# EAGLE design USBdimmer (EAGLE 6.4)
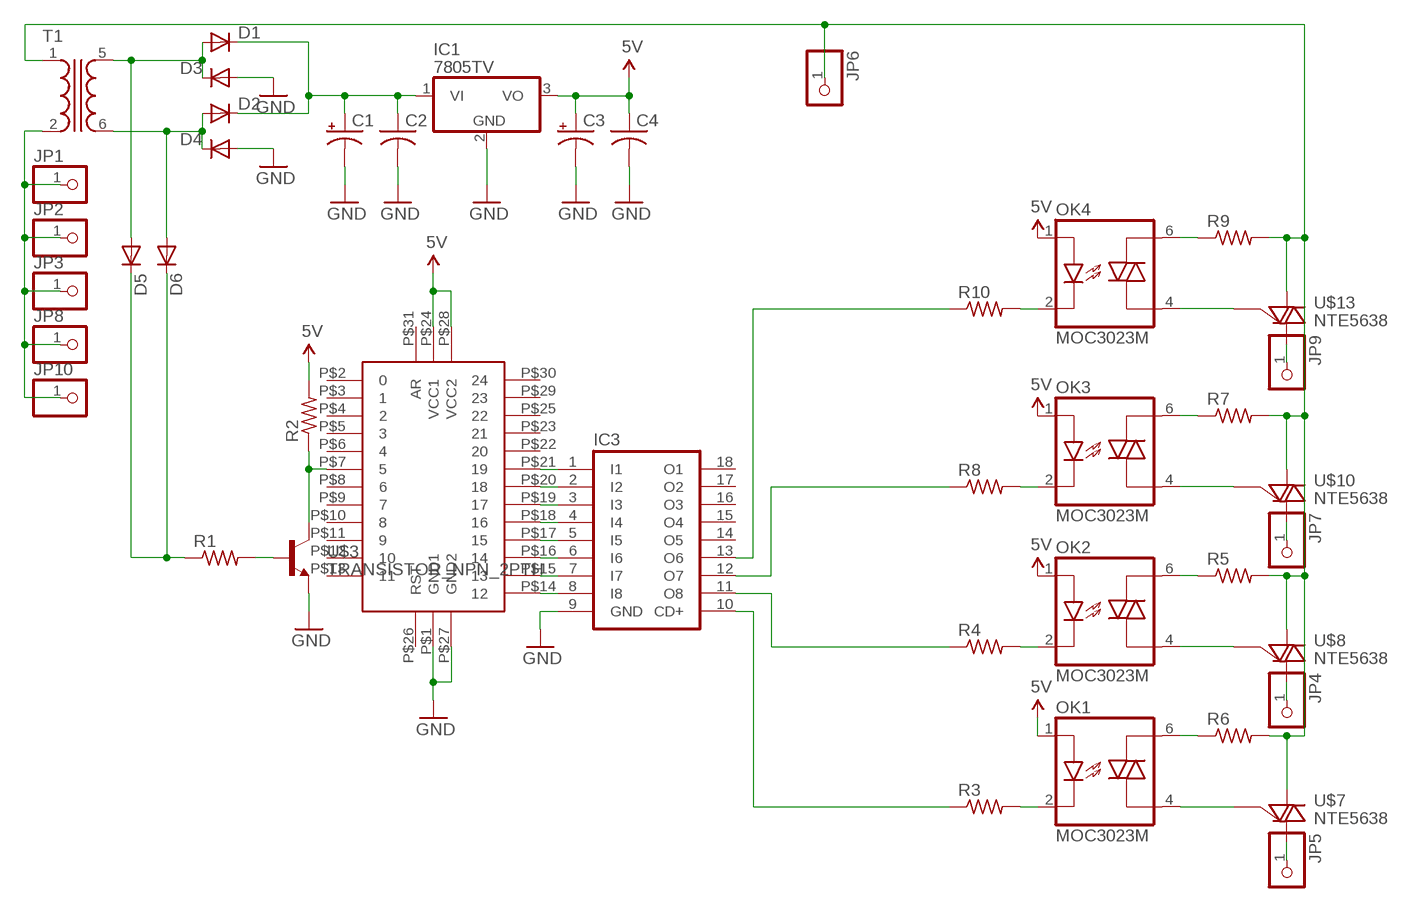
[diagram p0: schematic, sheet 1]

## Parts
C1  CPOL-USE3.5-10  [E3,5-10]
C2  C-US025-030X050  [C025-030X050]
C3  CPOL-USE3.5-10  [E3,5-10]
C4  C-US025-030X050  [C025-030X050]
D1  DIODEPTH  [DIODE-1N4001]
D2  DIODEPTH  [DIODE-1N4001]
D3  DIODEPTH  [DIODE-1N4001]
D4  DIODEPTH  [DIODE-1N4001]
D5  DIODE1N4148  [DIODE-1N4148]
D6  DIODE1N4148  [DIODE-1N4148]
IC1  7805TV  [TO220V]
IC3  ULN2803A  [DIL18]
JP1  PINHD-1X1  [1X01]
JP2  PINHD-1X1  [1X01]
JP3  PINHD-1X1  [1X01]
JP4  PINHD-1X1  [1X01]
JP5  PINHD-1X1  [1X01]
JP6  PINHD-1X1  [1X01]
JP7  PINHD-1X1  [1X01]
JP8  PINHD-1X1  [1X01]
JP9  PINHD-1X1  [1X01]
JP10  PINHD-1X1  [1X01]
OK1  MOC3023M  [DIL06]
OK2  MOC3023M  [DIL06]
OK3  MOC3023M  [DIL06]
OK4  MOC3023M  [DIL06]
R1  FLIPFLOP-RES  [0805-THM]
R2  FLIPFLOP-RES  [0805-THM]
R3  FLIPFLOP-RES  [0805-THM]
R4  FLIPFLOP-RES  [0805-THM]
R5  FLIPFLOP-RES  [0805-THM]
R6  FLIPFLOP-RES  [0805-THM]
R7  FLIPFLOP-RES  [0805-THM]
R8  FLIPFLOP-RES  [0805-THM]
R9  FLIPFLOP-RES  [0805-THM]
R10  FLIPFLOP-RES  [0805-THM]
T1  XFORMER  [T70-E]
U$1  TEENSY2  [TEENSY2]
U$3  TRANSISTOR_NPN_2PTH  [TO-92]
U$7  NTE5638  [TO220BV]
U$8  NTE5638  [TO220BV]
U$10  NTE5638  [TO220BV]
U$13  NTE5638  [TO220BV]

## Nets
5V: C3.+ C4.1 IC1.3(VO) OK1.1(A) OK2.1(A) OK3.1(A) OK4.1(A) R2.2 U$1.P$24(VCC1) U$1.P$28(VCC2)
GND: C1.- C2.2 C3.- C4.2 D3.A D4.A IC1.2(GND) IC3.9(GND) U$1.P$1(GND1) U$1.P$27(GND2) U$3.3(E)
N$1: D2.A D4.C D6.A T1.6(S2)
N$2: D1.A D3.C D5.A T1.5(S1)
N$3: C1.+ C2.1 D1.C D2.C IC1.1(VI)
N$4: IC3.1(I1) U$1.P$21
N$5: IC3.2(I2) U$1.P$20
N$6: R1.2 U$3.2(B)
N$7: D5.C D6.C R1.1
N$8: R2.1 U$1.P$7 U$3.1(C)
N$9: IC3.3(I3) U$1.P$19
N$10: IC3.4(I4) U$1.P$18
N$11: JP6.1 R5.2 R6.2 R7.2 R9.2 T1.1 U$7.1(MT1) U$8.1(MT1) U$10.1(MT1) U$13.1(MT1)
N$12: OK2.6(MT1) R5.1
N$13: OK2.4(MT2) U$8.3(G)
N$14: JP4.1 U$8.2(MT2)
N$15: OK1.6(MT1) R6.1
N$16: OK1.4(MT2) U$7.3(G)
N$17: JP5.1 U$7.2(MT2)
N$18: JP1.1 JP2.1 JP3.1 JP8.1 JP10.1 T1.2
N$19: IC3.5(I5) U$1.P$17
N$20: IC3.6(I6) U$1.P$16
N$21: OK3.6(MT1) R7.1
N$22: OK3.4(MT2) U$10.3(G)
N$23: JP7.1 U$10.2(MT2)
N$24: IC3.7(I7) U$1.P$15
N$25: IC3.8(I8) U$1.P$14
N$26: OK3.2(C) R8.2
N$27: OK2.2(C) R4.2
N$28: OK1.2(C) R3.2
N$30: OK4.6(MT1) R9.1
N$31: OK4.4(MT2) U$13.3(G)
N$32: JP9.1 U$13.2(MT2)
N$33: OK4.2(C) R10.2
N$34: IC3.10(CD+) R3.1
N$35: IC3.11(O8) R4.1
N$36: IC3.13(O6) R10.1
N$37: IC3.12(O7) R8.1
Unconnected: IC3.14(O5) IC3.15(O4) IC3.16(O3) IC3.17(O2) IC3.18(O1) T1.3(P1) T1.4(P2) T1.7(S1) T1.8(S2) U$1.P$2 U$1.P$3 U$1.P$4 U$1.P$5 U$1.P$6 U$1.P$8 U$1.P$9 U$1.P$10 U$1.P$11 U$1.P$12 U$1.P$13 U$1.P$22 U$1.P$23 U$1.P$25 U$1.P$26(RST) U$1.P$29 U$1.P$30 U$1.P$31(AR)

## Library data of the parts
C1 C3 = adafruit:CPOL-US: POLARIZED CAPACITOR, American symbol
C2 C4 = adafruit:C-US: CAPACITOR, American symbol
D1-D6 = SparkFun-DiscreteSemi:DIODE: Diode These are standard reverse protection diodes and small signal diodes. SMA package can handle up to about 1A. SOD-323 can handle about 200mA. What the SOD-323 package when ordering, there are some mfgs out there that are 5-pin packages.
IC1 = linear:78*: Positive VOLTAGE REGULATOR Source: http://cache.national.com/ds/LM/LM78L05.pdf http://www.fairchildsemi.com/ds/LM/LM7805.pdf
IC3 = uln-udn:ULN2803A: DRIVER ARRAY
JP1-JP10 = adafruit:PINHD-1X1: Pin header 1x1 for 0.1" spacing With round pins
OK1-OK4 = bodger:MOC30*M: RANDOM-PHASE OPTOISOLATORS TRIAC DRIVER OUTPUT Source: http://www.fairchildsemi.com MOC3020-M.pdf; MF: FAIRCHILD SEMICONDUCTOR; MPN: MOC3023-M; OC_FARNELL: 1021367; OC_NEWARK: 72K8896
R1-R10 = adafruit:FLIPFLOP-RES: Flip Flop resistor An 0805 resistor inside a standard 1/4W 5% resistor. Makes for easy mods
T1 = special:XFORMER: TRANSFORMER 2 x primary, 2 x secondary
U$1 = bodger:TEENSY2
U$3 = SparkFun-DiscreteSemi:TRANSISTOR_NPN_2: Alternate TO-92 NPN BJT
U$7 U$8 U$10 U$13 = bodger:NTE5638

## Board
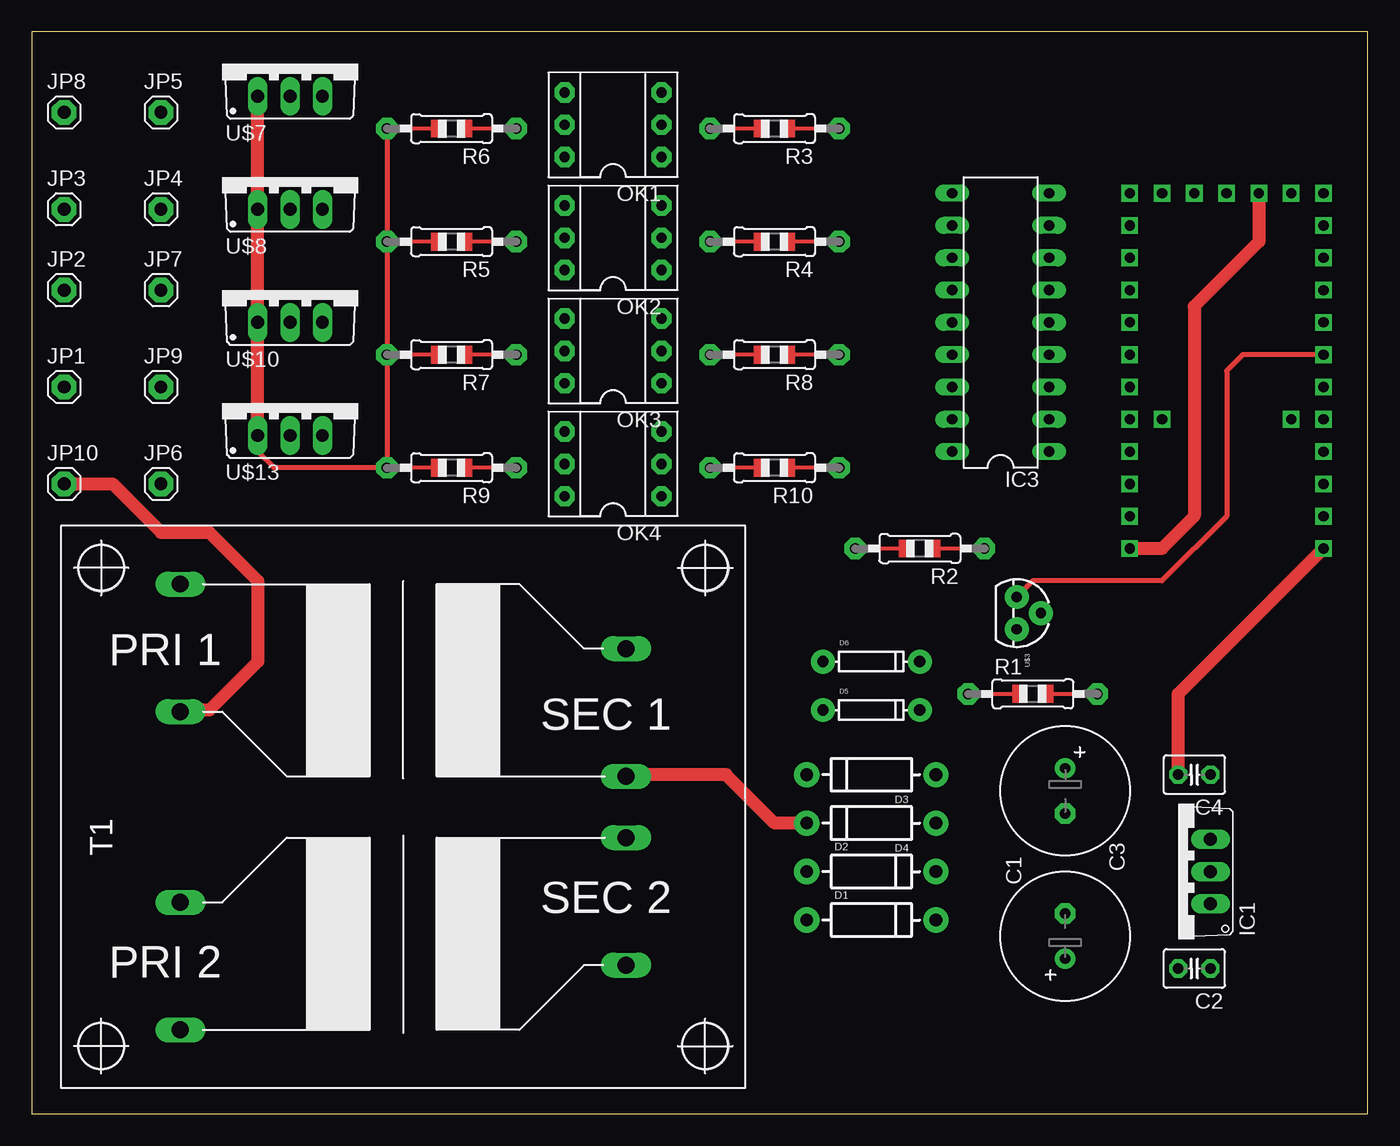
[diagram p1: board, top side]
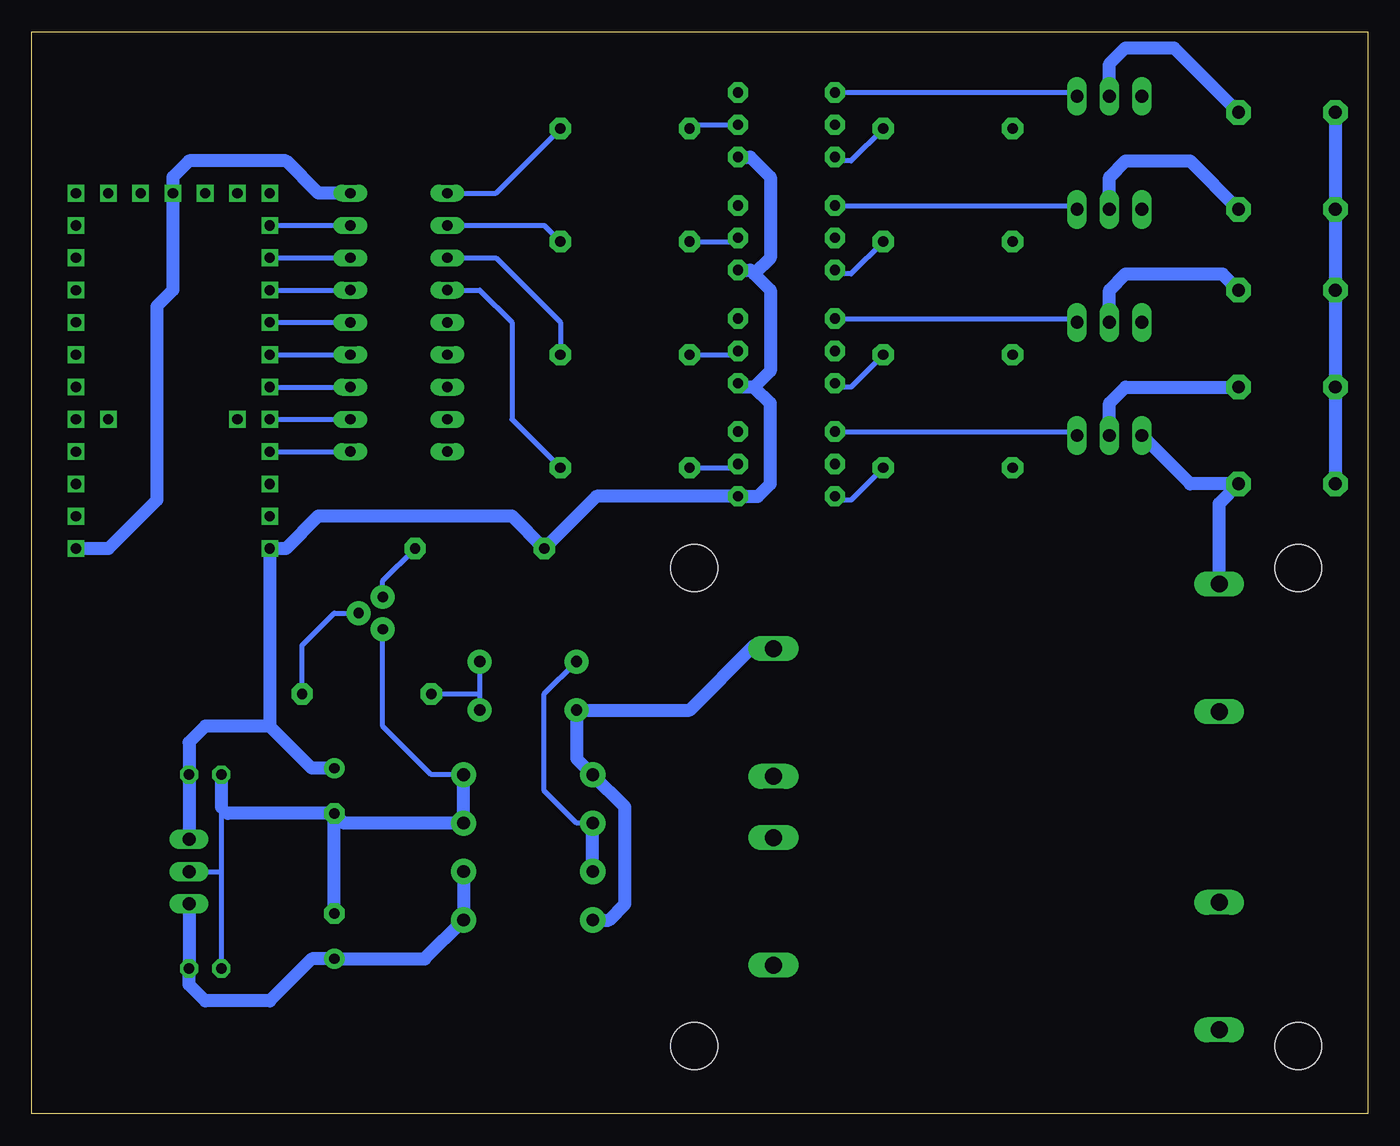
[diagram p2: board, bottom side, seen from below]

Size 105.08 x 85.08 mm. Coordinates in mm from the lower left corner, seen from the top.
Outline: 0,0 105.08,0 105.08,85.08 0,85.08 0,0
Copper layers (1*16): Top 0.035mm / dielectric 1.5mm / Bottom 0.035mm
Design rules "default": minimum track width 10mil, minimum drill 24mil, track to track 8mil, track to pad 8mil, pad to pad 8mil, via to via 8mil, smd to smd 8mil, copper to edge 40mil, drill to drill 8mil, minimum pad ring 10mil, minimum via ring 8mil, stop-mask expansion 4mil, vias tented up to drill 0mil, thermal gap 10mil

### Footprints (pad centres in the part's own frame; a part is rotated, then mirrored left to right if it is on the bottom)
E3,5-10 = drill 0.813 pad 1.6: + -1.778,0 | drill 0.813 pad 1.6 octagon: - 1.778,0
C025-030X050 = drill 0.813 pad 1.422 octagon: 1 -1.27,0; 2 1.27,0
DIODE-1N4001 = drill 1 pad 1.981: A -5.08,0; C 5.08,0
DIODE-1N4148 = drill 0.9 pad 1.88: A -3.81,0; C 3.81,0
TO220V = drill 1.016 long: 1 -2.54,-2.54; 2 0,-2.54; 3 2.54,-2.54
DIL18 = drill 0.813 long: 1 -10.16,-3.81; 2 -7.62,-3.81; 3 -5.08,-3.81; 4 -2.54,-3.81; 5 0,-3.81; 6 2.54,-3.81; 7 5.08,-3.81; 8 7.62,-3.81; 9 10.16,-3.81; 10 10.16,3.81; 11 7.62,3.81; 12 5.08,3.81; 13 2.54,3.81; 14 0,3.81; 15 -2.54,3.81; 16 -5.08,3.81; 17 -7.62,3.81; 18 -10.16,3.81
1X01 = drill 1.016 pad 1.93 octagon: 1 0,0
DIL06 = drill 0.813 pad 1.6 octagon: 1 -3.51,-3.81; 2 -0.97,-3.81; 3 1.57,-3.81; 4 1.57,3.81; 5 -0.97,3.81; 6 -3.51,3.81
0805-THM = drill 0.813 pad 1.676 octagon: 1 -5.08,0; 2 5.08,0
T70-E = drill 1.321 long: 1 -17.526,17.526; 2 -17.526,7.493; 3 -17.526,-7.493; 4 -17.526,-17.526; 5 17.526,12.446; 6 17.526,2.413; 7 17.526,-2.413; 8 17.526,-12.446 | hole 3.708: 23.749,18.796; 23.749,-18.796; -23.749,-18.796; -23.749,18.796
TEENSY2 = drill 0.8 square: P$1 -7.62,15.24; P$2 -7.62,12.7; P$3 -7.62,10.16; P$4 -7.62,7.62; P$5 -7.62,5.08; P$6 -7.62,2.54; P$7 -7.62,0; P$8 -7.62,-2.54; P$9 -7.62,-5.08; P$10 -7.62,-7.62; P$11 -7.62,-10.16; P$12 -7.62,-12.7; P$13 7.62,-12.7; P$14 7.62,-10.16; P$15 7.62,-7.62; P$16 7.62,-5.08; P$17 7.62,-2.54; P$18 7.62,0; P$19 7.62,2.54; P$20 7.62,5.08; P$21 7.62,7.62; P$22 7.62,10.16; P$23 7.62,12.7; P$24 7.62,15.24; P$25 5.08,-12.7; P$26 2.54,-12.7; P$27 0,-12.7; P$28 -2.54,-12.7; P$29 -5.08,-12.7; P$30 -5.08,5.08; P$31 5.08,5.08
TO-92 = drill 0.813 pad 1.88: 1 -1.27,0; 2 0,1.905; 3 1.27,0
TO220BV = drill 1.016 long: 1 -2.54,-2.54; 2 0,-2.54; 3 2.54,-2.54

### Placement (x,y rotation side)
C1  81.28,13.97 90 top
C2  91.44,11.43 180 top
C3  81.28,25.4 270 top
C4  91.44,26.67 180 top
D1  66.04,15.24 0 top
D2  66.04,19.05 0 top
D3  66.04,26.67 180 top
D4  66.04,22.86 180 top
D5  66.04,31.75 0 top
D6  66.04,35.56 0 top
IC1  90.17,19.05 90 top
IC3  76.2,62.23 90 top
JP1  2.54,57.15 0 top
JP2  2.54,64.77 0 top
JP3  2.54,71.12 0 top
JP4  10.16,71.12 0 top
JP5  10.16,78.74 0 top
JP6  10.16,49.53 0 top
JP7  10.16,64.77 0 top
JP8  2.54,78.74 0 top
JP9  10.16,57.15 0 top
JP10  2.54,49.53 0 top
OK1  45.72,78.74 90 top
OK2  45.72,69.85 90 top
OK3  45.72,60.96 90 top
OK4  45.72,52.07 90 top
R1  78.74,33.02 0 top
R2  69.85,44.45 180 top
R3  58.42,77.47 180 top
R4  58.42,68.58 180 top
R5  33.02,68.58 180 top
R6  33.02,77.47 180 top
R7  33.02,59.69 180 top
R8  58.42,59.69 180 top
R9  33.02,50.8 180 top
R10  58.42,50.8 180 top
T1  29.21,24.13 0 top
U$1  93.98,59.69 180 top
U$3  77.47,39.37 270 top
U$7  20.32,82.55 0 top
U$8  20.32,73.66 0 top
U$10  20.32,64.77 0 top
U$13  20.32,55.88 0 top

### Tracks (layer width: path | path; a pad name or v marks a point on that pad's centre or on a via)
5V
  Top 1.016: U$1.P$28 96.52,68.58 91.44,63.5 91.44,46.99 88.9,44.45 U$1.P$24
  Bottom 0.406: OK2.1 49.23,66.04 48.26,66.04 48.56,66.34 | 49.23,57.15 OK3.1
  Bottom 1.016: OK1.1 48.56,75.23 46.99,73.66 46.99,67.31 48.26,66.04 46.99,64.77 46.99,58.42 48.26,57.15 | OK2.1 48.56,66.34 | 48.26,57.15 49.23,57.15 | 48.26,57.15 46.99,55.88 46.99,49.53 47.96,48.56 OK4.1 60.66,48.56 R2.2 67.31,46.99 82.55,46.99 85.09,44.45 U$1.P$24 86.36,30.48 | IC1.3 C4.1 92.71,29.21 91.44,30.48 86.36,30.48 | C3.+ 83.06,27.18 86.36,30.48
GND
  Top 1.016: C4.2 90.17,33.02 U$1.P$1
  Bottom 0.406: 90.17,19.05 90.17,24.13 89.66,23.62 | 90.17,19.05 C2.2 | IC1.2 90.17,19.05 | D3.A 73.66,26.67 77.47,30.48 U$3.3
  Bottom 1.016: D3.A D4.A 80.52,22.86 C3.- | C4.2 90.17,24.13 | C1.- C3.- | C3.- 89.66,23.62 | IC3.9 82.55,72.39 85.09,74.93 92.71,74.93 93.98,73.66 U$1.P$27 93.98,64.77 95.25,63.5 95.25,48.26 99.06,44.45 U$1.P$1
N$1
  Top 1.016: D4.C 58.42,22.86 54.61,26.67 46.86,26.67 T1.6
  Bottom 0.406: D4.C 62.23,22.86 64.77,25.4 64.77,33.02 D6.A
  Bottom 1.016: D2.A D4.C
N$2
  Bottom 1.016: D1.A 59.69,15.24 58.42,16.51 58.42,24.13 D3.C 62.23,27.94 D5.A 53.34,31.75 48.26,36.83 46.99,36.83 T1.5
N$3
  Bottom 1.016: D2.C D1.C 74.17,12.19 C1.+ 83.06,12.19 86.36,8.89 91.44,8.89 92.71,10.16 C2.1 IC1.1
N$4
  Bottom 0.406: U$1.P$21 IC3.1
N$5
  Bottom 0.406: U$1.P$20 IC3.2
N$6
  Bottom 0.406: R1.2 83.82,36.83 81.28,39.37 U$3.2
N$7
  Bottom 0.406: D6.C 69.85,33.02 | 69.85,33.02 D5.C | R1.1 69.85,33.02
N$8
  Top 0.406: U$1.P$7 95.25,59.69 93.98,58.42 93.98,46.99 88.9,41.91 78.74,41.91 U$3.1
  Bottom 0.406: U$3.1 77.47,41.91 R2.1
N$9
  Bottom 0.406: U$1.P$19 IC3.3
N$10
  Bottom 0.406: U$1.P$18 IC3.4
N$11
  Top 0.406: R9.2 R7.2 R5.2 R6.2 R9.2 | R9.2 19.05,50.8 17.78,52.07 U$13.1
  Top 1.016: U$13.1 U$10.1 U$8.1 U$7.1
  Bottom 1.016: T1.1 11.68,48.01 JP6.1 13.97,49.53 U$13.1
N$12
  Bottom 0.406: R5.1 40.64,66.04 41.61,66.04 OK2.6
N$13
  Bottom 0.406: OK2.4 23.16,71.42 U$8.3
N$14
  Bottom 1.016: U$8.2 20.32,73.66 19.05,74.93 13.97,74.93 JP4.1
N$15
  Bottom 0.406: R6.1 40.64,74.93 41.61,74.93 OK1.6
N$16
  Bottom 0.406: OK1.4 23.16,80.31 U$7.3
N$17
  Bottom 1.016: U$7.2 20.32,82.55 19.05,83.82 15.24,83.82 JP5.1
N$18
  Top 0.406: 11.81,31.75 T1.2
  Top 1.016: JP10.1 6.35,49.53 10.16,45.72 13.97,45.72 17.78,41.91 17.78,35.56 13.97,31.75 11.81,31.75
  Bottom 0.406: 2.54,55.88 JP1.1
  Bottom 1.016: JP8.1 JP3.1 JP2.1 JP1.1 JP10.1
N$19
  Bottom 0.406: U$1.P$17 IC3.5
N$20
  Bottom 0.406: U$1.P$16 IC3.6
N$21
  Bottom 0.406: R7.1 40.64,57.15 41.61,57.15 OK3.6
N$22
  Bottom 0.406: OK3.4 23.16,62.53 U$10.3
N$23
  Bottom 1.016: U$10.2 20.32,64.77 19.05,66.04 11.43,66.04 JP7.1
N$24
  Bottom 0.406: U$1.P$15 IC3.7
N$25
  Bottom 0.406: U$1.P$14 IC3.8
N$26
  Bottom 0.406: R8.2 49.53,59.69 OK3.2
N$27
  Bottom 0.406: R4.2 49.53,68.58 OK2.2
N$28
  Bottom 0.406: R3.2 53.34,77.77 OK1.2
N$30
  Bottom 0.406: R9.1 40.64,48.26 41.61,48.26 OK4.6
N$31
  Bottom 0.406: OK4.4 23.16,53.64 U$13.3
N$32
  Bottom 1.016: U$13.2 20.32,55.88 19.05,57.15 JP9.1
N$33
  Bottom 0.406: R10.2 49.53,50.8 OK4.2
N$34
  Bottom 0.406: IC3.10 68.58,72.39 R3.1
N$35
  Bottom 0.406: IC3.11 64.77,69.85 R4.1
N$36
  Bottom 0.406: IC3.13 69.85,64.77 67.31,62.23 67.31,54.61 R10.1
N$37
  Bottom 0.406: IC3.12 68.58,67.31 63.5,62.23 R8.1